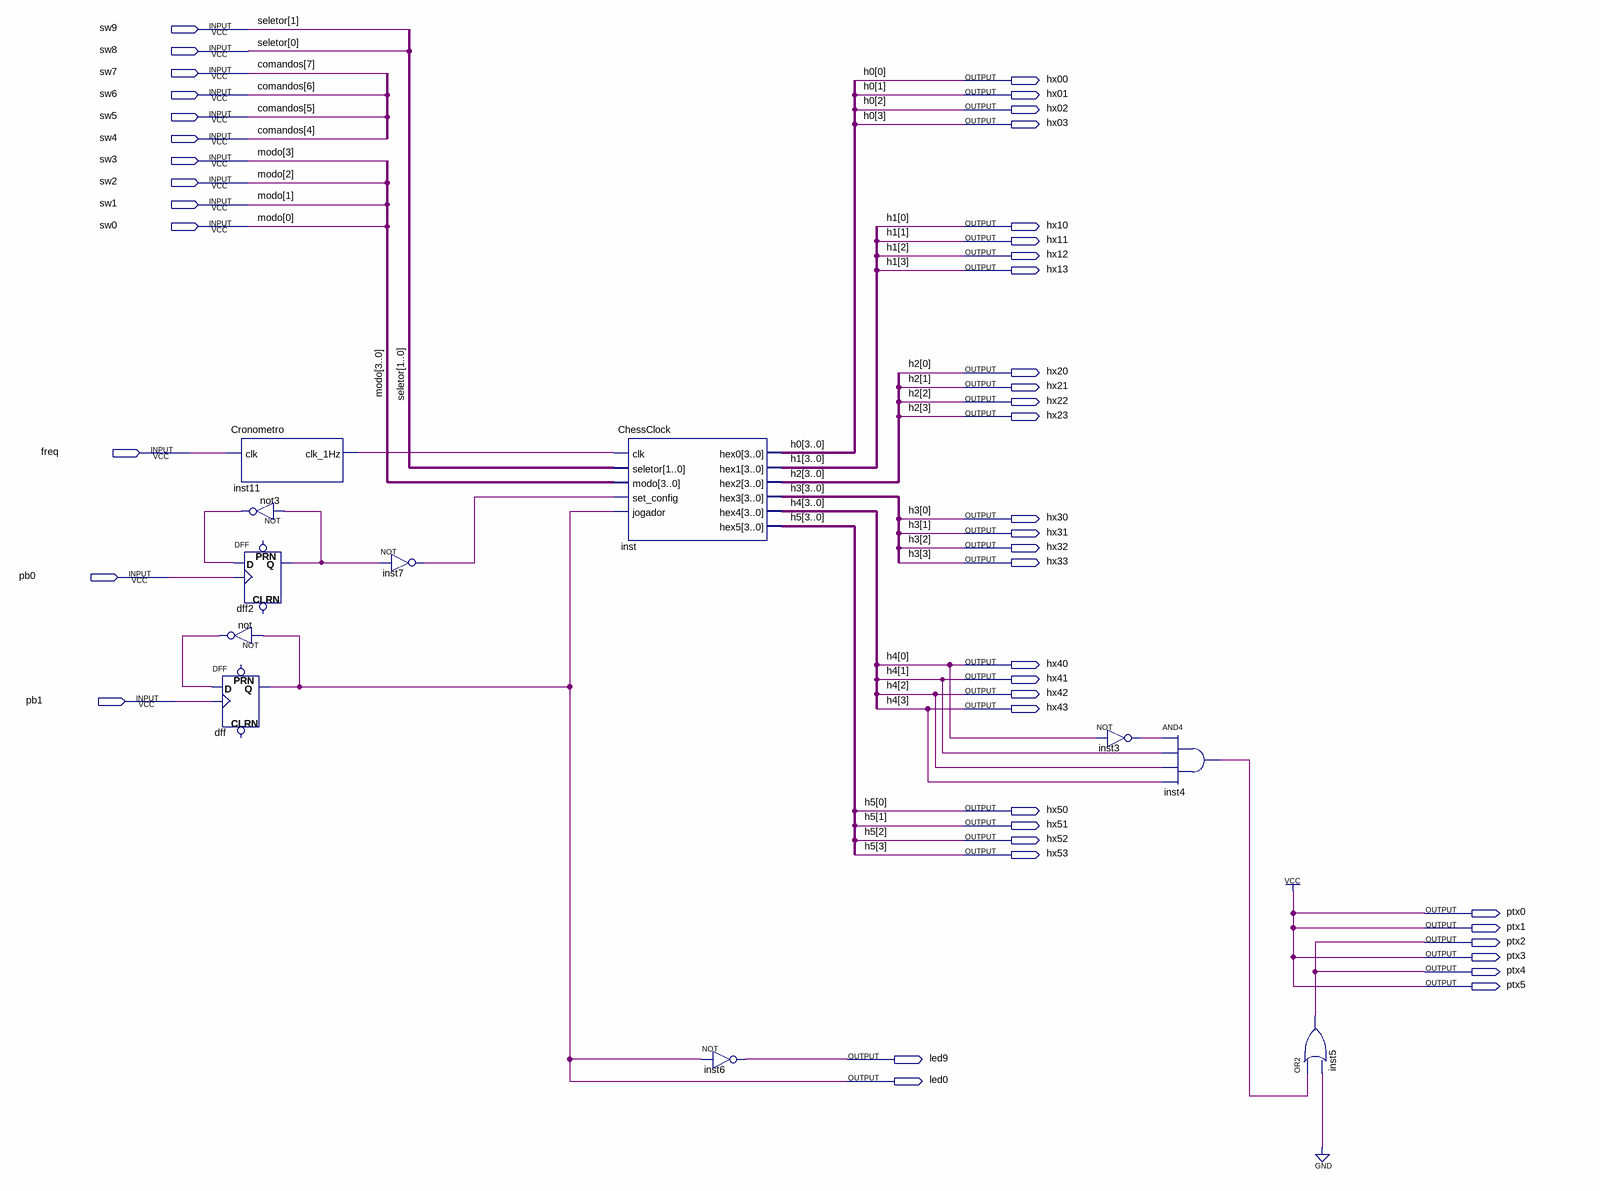
[diagram p0: schematic sheet]
// Quartus schematic ControleGeralXadrez.bdf as structural Verilog: 11 symbols, 45 pins
module ControleGeralXadrez (
  input  sw9,
  input  sw8,
  input  sw7,
  input  sw6,
  input  sw5,
  input  sw4,
  input  sw3,
  input  sw2,
  input  sw1,
  input  sw0,
  input  freq,
  input  pb0,
  input  pb1,
  output hx00,
  output hx01,
  output hx02,
  output hx03,
  output hx10,
  output hx11,
  output hx12,
  output hx13,
  output hx20,
  output hx21,
  output hx22,
  output hx23,
  output hx30,
  output hx31,
  output hx32,
  output hx33,
  output hx40,
  output hx41,
  output hx42,
  output hx43,
  output hx50,
  output hx51,
  output hx52,
  output hx53,
  output ptx0,
  output ptx1,
  output ptx2,
  output ptx3,
  output ptx4,
  output ptx5,
  output led9,
  output led0
);

  wire dff2_q, inst3_out, inst4_out, inst7_out, inst11_clk_1hz, not3_out, not_out;

  Cronometro inst11 (.clk(freq), .clk_1Hz(inst11_clk_1hz));
  not not3 (not3_out, dff2_q);
  DFF dff2 (.CLK(pb0), .D(not3_out), .Q(dff2_q));  // open: CLRN, PRN
  not \not  (not_out, led0);
  DFF dff (.CLK(pb1), .D(not_out), .Q(led0));  // open: CLRN, PRN
  not inst7 (inst7_out, dff2_q);
  ChessClock inst (
    .clk(inst11_clk_1hz), .seletor({sw9, sw8}), .modo({sw3, sw2, sw1, sw0}), .set_config(inst7_out),
    .jogador(led0), .hex0({hx03, hx02, hx01, hx00}), .hex1({hx13, hx12, hx11, hx10}),
    .hex2({hx23, hx22, hx21, hx20}), .hex3({hx33, hx32, hx31, hx30}), .hex4({hx43, hx42, hx41, hx40}),
    .hex5({hx53, hx52, hx51, hx50}));
  not inst6 (led9, led0);
  not inst3 (inst3_out, hx40);
  and inst4 (inst4_out, inst3_out, hx41, hx42, hx43);
  or inst5 (ptx2, inst4_out, 1'b0);

  assign ptx0 = 1'b1;
  assign ptx1 = 1'b1;
  assign ptx3 = 1'b1;
  assign ptx4 = ptx2;
  assign ptx5 = 1'b1;

  // Other names for the same wires on the sheet: comandos[7:4] = {sw7, sw6, sw5, sw4};
  //   h0[3:0] = {hx03, hx02, hx01, hx00}; h1[3:0] = {hx13, hx12, hx11, hx10}; h2[3:0] = {hx23, hx22, hx21, hx20};
  //   h3[3:0] = {hx33, hx32, hx31, hx30}; h4[3:0] = {hx43, hx42, hx41, hx40}; h5[3:0] = {hx53, hx52, hx51, hx50};
  //   modo[3:0] = {sw3, sw2, sw1, sw0}; seletor[1:0] = {sw9, sw8}
endmodule
